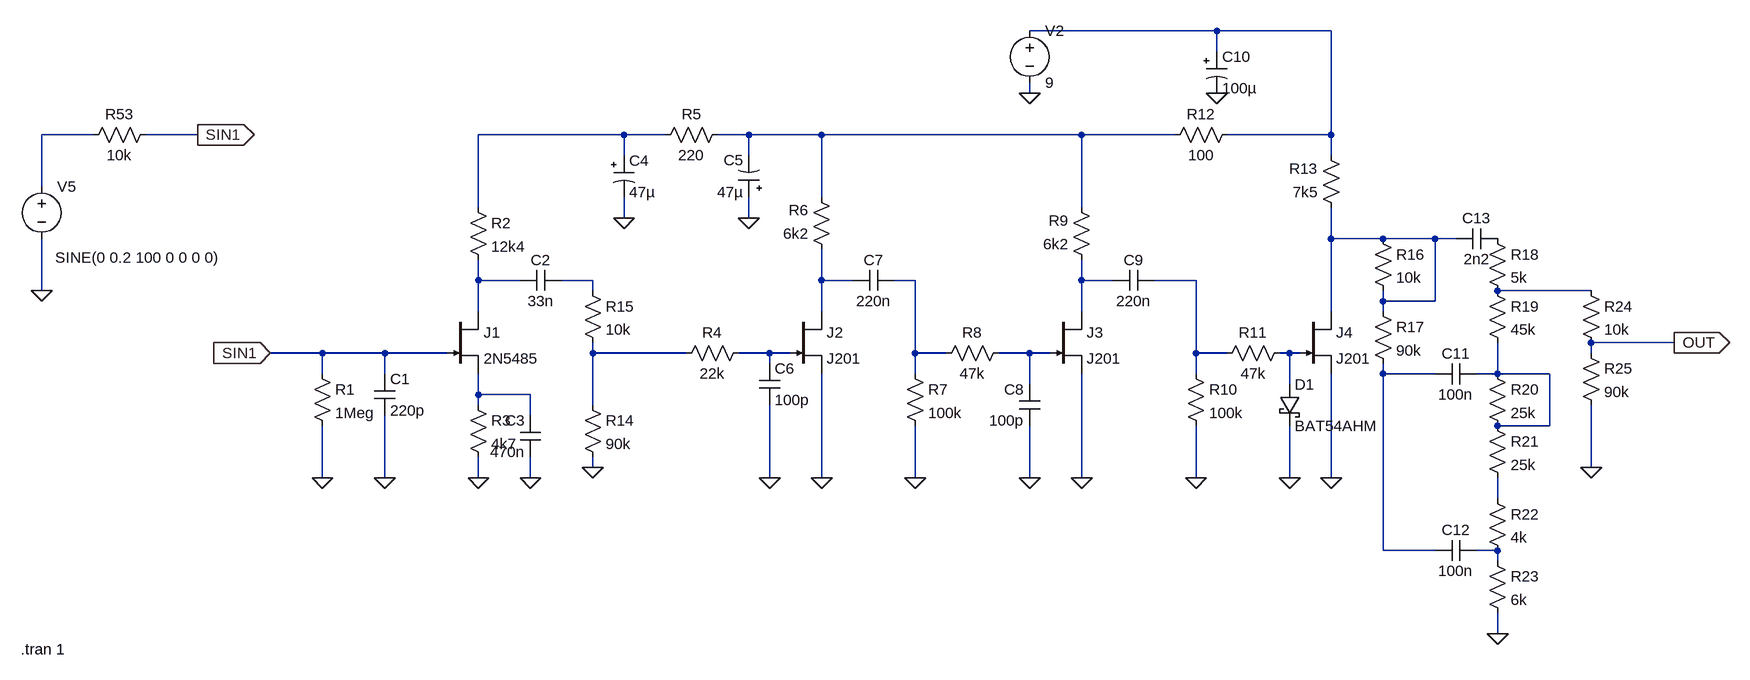
[diagram p0: schematic krankenbox_oscillations.asc]
krankenbox_oscillations.asc, the LTspice schematic file:
Version 4
SHEET 1 4396 1780
WIRE 1360 -400 1072 -400
WIRE 1536 -400 1360 -400
WIRE 1360 -368 1360 -400
WIRE 1072 -304 1072 -320
WIRE -368 -240 -448 -240
WIRE -208 -240 -288 -240
WIRE 448 -240 224 -240
WIRE 512 -240 448 -240
WIRE 640 -240 592 -240
WIRE 752 -240 640 -240
WIRE 1152 -240 752 -240
WIRE 1296 -240 1152 -240
WIRE 1536 -240 1536 -400
WIRE 1536 -240 1376 -240
WIRE 448 -208 448 -240
WIRE 640 -208 640 -240
WIRE 1536 -208 1536 -240
WIRE -448 -160 -448 -240
WIRE 752 -144 752 -240
WIRE 224 -128 224 -240
WIRE 1152 -128 1152 -240
WIRE 448 -112 448 -144
WIRE 640 -112 640 -144
WIRE 1536 -80 1536 -128
WIRE 1616 -80 1536 -80
WIRE 1696 -80 1616 -80
WIRE 1728 -80 1696 -80
WIRE 224 -16 224 -48
WIRE 288 -16 224 -16
WIRE 400 -16 352 -16
WIRE 752 -16 752 -64
WIRE 800 -16 752 -16
WIRE 896 -16 864 -16
WIRE 1152 -16 1152 -48
WIRE 1200 -16 1152 -16
WIRE 1328 -16 1264 -16
WIRE -448 0 -448 -80
WIRE 400 0 400 -16
WIRE 1936 0 1792 0
WIRE 1616 16 1616 0
WIRE 1696 16 1696 -80
WIRE 1696 16 1616 16
WIRE 224 32 224 -16
WIRE 752 32 752 -16
WIRE 1152 32 1152 -16
WIRE 1536 32 1536 -80
WIRE 1616 32 1616 16
WIRE 2064 80 1936 80
WIRE -16 96 -96 96
WIRE 80 96 -16 96
WIRE 176 96 80 96
WIRE 400 96 400 80
WIRE 544 96 400 96
WIRE 672 96 624 96
WIRE 704 96 672 96
WIRE 896 96 896 -16
WIRE 944 96 896 96
WIRE 1072 96 1024 96
WIRE 1104 96 1072 96
WIRE 1328 96 1328 -16
WIRE 1376 96 1328 96
WIRE 1472 96 1456 96
WIRE 1488 96 1472 96
WIRE 1936 96 1936 80
WIRE 672 112 672 96
WIRE -16 128 -16 96
WIRE 80 128 80 96
WIRE 896 128 896 96
WIRE 1328 128 1328 96
WIRE 1616 128 1616 112
WIRE 1696 128 1616 128
WIRE 1792 128 1792 80
WIRE 1792 128 1760 128
WIRE 1872 128 1792 128
WIRE 1072 144 1072 96
WIRE 1472 144 1472 96
WIRE 224 160 224 128
WIRE 304 160 224 160
WIRE 224 176 224 160
WIRE 400 176 400 96
WIRE 304 192 304 160
WIRE 1872 208 1872 128
WIRE 1872 208 1792 208
WIRE 400 272 400 256
WIRE 1936 272 1936 176
WIRE -16 288 -16 208
WIRE 80 288 80 192
WIRE 224 288 224 256
WIRE 304 288 304 256
WIRE 672 288 672 176
WIRE 752 288 752 128
WIRE 896 288 896 208
WIRE 1072 288 1072 208
WIRE 1152 288 1152 128
WIRE 1328 288 1328 208
WIRE 1472 288 1472 208
WIRE 1536 288 1536 128
WIRE 1792 320 1792 288
WIRE 1616 400 1616 128
WIRE 1696 400 1616 400
WIRE 1792 400 1760 400
WIRE 1792 416 1792 400
WIRE 1792 528 1792 496
FLAG -16 288 0
FLAG 80 288 0
FLAG 224 288 0
FLAG 304 288 0
FLAG 672 288 0
FLAG 752 288 0
FLAG 896 288 0
FLAG 1072 288 0
FLAG 1152 288 0
FLAG 1328 288 0
FLAG 1536 288 0
FLAG 448 -112 0
FLAG 640 -112 0
FLAG 1792 528 0
FLAG 1936 272 0
FLAG 1360 -304 0
FLAG 400 272 0
FLAG 1072 -304 0
FLAG -96 96 SIN1
IOPIN -96 96 In
FLAG 1472 288 0
FLAG -448 0 0
FLAG -208 -240 SIN1
IOPIN -208 -240 Out
FLAG 2064 80 OUT
IOPIN 2064 80 Out
SYMBOL res -32 112 R0
SYMATTR InstName R1
SYMATTR Value 1Meg
SYMBOL res 208 -144 R0
SYMATTR InstName R2
SYMATTR Value 12k4
SYMBOL res 208 160 R0
SYMATTR InstName R3
SYMATTR Value 4k7
SYMBOL res 640 80 R90
WINDOW 0 0 56 VBottom 2
WINDOW 3 32 56 VTop 2
SYMATTR InstName R4
SYMATTR Value 22k
SYMBOL res 608 -256 R90
WINDOW 0 0 56 VBottom 2
WINDOW 3 32 56 VTop 2
SYMATTR InstName R5
SYMATTR Value 220
SYMBOL res 768 -48 R180
WINDOW 0 36 76 Left 2
WINDOW 3 36 40 Left 2
SYMATTR InstName R6
SYMATTR Value 6k2
SYMBOL res 880 112 R0
SYMATTR InstName R7
SYMATTR Value 100k
SYMBOL res 1040 80 R90
WINDOW 0 0 56 VBottom 2
WINDOW 3 32 56 VTop 2
SYMATTR InstName R8
SYMATTR Value 47k
SYMBOL res 1168 -32 R180
WINDOW 0 36 76 Left 2
WINDOW 3 36 40 Left 2
SYMATTR InstName R9
SYMATTR Value 6k2
SYMBOL res 1312 112 R0
SYMATTR InstName R10
SYMATTR Value 100k
SYMBOL res 1472 80 R90
WINDOW 0 0 56 VBottom 2
WINDOW 3 32 56 VTop 2
SYMATTR InstName R11
SYMATTR Value 47k
SYMBOL res 1392 -256 R90
WINDOW 0 0 56 VBottom 2
WINDOW 3 32 56 VTop 2
SYMATTR InstName R12
SYMATTR Value 100
SYMBOL res 1552 -112 R180
WINDOW 0 36 76 Left 2
WINDOW 3 36 40 Left 2
SYMATTR InstName R13
SYMATTR Value 7k5
SYMBOL cap 64 128 R0
SYMATTR InstName C1
SYMATTR Value 220p
SYMBOL cap 352 -32 R90
WINDOW 0 0 32 VBottom 2
WINDOW 3 32 32 VTop 2
SYMATTR InstName C2
SYMATTR Value 33n
SYMBOL cap 320 256 R180
WINDOW 0 24 56 Left 2
WINDOW 3 24 8 Left 2
SYMATTR InstName C3
SYMATTR Value 470n
SYMBOL polcap 432 -208 R0
SYMATTR InstName C4
SYMATTR Value 47µ
SYMATTR Description Capacitor
SYMATTR Type cap
SYMATTR SpiceLine V=25 Irms=170m Rser=1 Lser=0 mfg="Nichicon" pn="UPG1E470MPH" type="Al electrolytic"
SYMBOL polcap 656 -144 R180
WINDOW 0 24 57 Left 2
WINDOW 3 24 8 Left 2
SYMATTR InstName C5
SYMATTR Value 47µ
SYMATTR Description Capacitor
SYMATTR Type cap
SYMATTR SpiceLine V=25 Irms=170m Rser=1 Lser=0 mfg="Nichicon" pn="UPG1E470MPH" type="Al electrolytic"
SYMBOL cap 656 112 R0
SYMATTR InstName C6
SYMATTR Value 100p
SYMBOL cap 864 -32 R90
WINDOW 0 0 32 VBottom 2
WINDOW 3 32 32 VTop 2
SYMATTR InstName C7
SYMATTR Value 220n
SYMBOL cap 1088 208 R180
WINDOW 0 24 56 Left 2
WINDOW 3 24 8 Left 2
SYMATTR InstName C8
SYMATTR Value 100p
SYMBOL cap 1200 0 R270
WINDOW 0 32 32 VTop 2
WINDOW 3 0 32 VBottom 2
SYMATTR InstName C9
SYMATTR Value 220n
SYMBOL polcap 1344 -368 R0
WINDOW 3 24 56 Left 2
SYMATTR Value 100µ
SYMATTR InstName C10
SYMATTR Description Capacitor
SYMATTR Type cap
SYMATTR SpiceLine V=16 Irms=170m Rser=1 Lser=0 mfg="Nichicon" pn="UPG1C101MPH" type="Al electrolytic"
SYMBOL cap 1760 112 R90
WINDOW 0 0 32 VBottom 2
WINDOW 3 32 32 VTop 2
SYMATTR InstName C11
SYMATTR Value 100n
SYMBOL cap 1760 384 R90
WINDOW 0 0 32 VBottom 2
WINDOW 3 32 32 VTop 2
SYMATTR InstName C12
SYMATTR Value 100n
SYMBOL cap 1792 -96 R90
WINDOW 0 0 32 VBottom 2
WINDOW 3 32 32 VTop 2
SYMATTR InstName C13
SYMATTR Value 2n2
SYMBOL njf 176 32 R0
SYMATTR InstName J1
SYMATTR Value 2N5485
SYMBOL res 384 160 R0
SYMATTR InstName R14
SYMATTR Value 90k
SYMBOL res 384 -16 R0
SYMATTR InstName R15
SYMATTR Value 10k
SYMBOL res 1600 -96 R0
SYMATTR InstName R16
SYMATTR Value 10k
SYMBOL res 1600 16 R0
SYMATTR InstName R17
SYMATTR Value 90k
SYMBOL res 1776 -96 R0
SYMATTR InstName R18
SYMATTR Value 5k
SYMBOL res 1776 -16 R0
SYMATTR InstName R19
SYMATTR Value 45k
SYMBOL res 1776 112 R0
SYMATTR InstName R20
SYMATTR Value 25k
SYMBOL res 1776 192 R0
SYMATTR InstName R21
SYMATTR Value 25k
SYMBOL res 1776 304 R0
SYMATTR InstName R22
SYMATTR Value 4k
SYMBOL res 1776 400 R0
SYMATTR InstName R23
SYMATTR Value 6k
SYMBOL res 1920 -16 R0
SYMATTR InstName R24
SYMATTR Value 10k
SYMBOL res 1920 80 R0
SYMATTR InstName R25
SYMATTR Value 90k
SYMBOL voltage 1072 -416 R0
WINDOW 123 0 0 Left 2
WINDOW 39 0 0 Left 2
SYMATTR InstName V2
SYMATTR Value 9
SYMBOL njf 704 32 R0
SYMATTR InstName J2
SYMATTR Value J201
SYMBOL njf 1104 32 R0
SYMATTR InstName J3
SYMATTR Value J201
SYMBOL njf 1488 32 R0
SYMATTR InstName J4
SYMATTR Value J201
SYMBOL voltage -448 -176 R0
WINDOW 3 21 125 Left 2
WINDOW 39 0 0 Left 2
SYMATTR Value SINE(0 0.2 100 0 0 0 0)
SYMATTR Value2 AC 1V
SYMATTR InstName V5
SYMBOL res -272 -256 R90
WINDOW 0 0 56 VBottom 2
WINDOW 3 32 56 VTop 2
SYMATTR InstName R53
SYMATTR Value 10k
SYMBOL schottky 1456 144 R0
SYMATTR InstName D1
SYMATTR Value BAT54AHM
SYMATTR Description Diode
SYMATTR Type diode
TEXT -480 552 Left 2 !.tran 1

The netlist it stands for:
* krankenbox_oscillations.asc
R1 SIN1 0 1Meg
R2 N003 N006 12k4
R3 N019 0 4k7
R4 N014 N013 22k
R5 N004 N003 220
R6 N008 N004 6k2
R7 N009 0 100k
R8 N015 N009 47k
R9 N010 N004 6k2
R10 N011 0 100k
R11 N016 N011 47k
R12 N001 N004 100
R13 N005 N001 7k5
C1 SIN1 0 220p
C2 N007 N006 33n
C3 0 N019 470n
C4 N003 0 47µ V=25 Irms=170m Rser=1 Lser=0 mfg="Nichicon" pn="UPG1E470MPH" type="Al electrolytic"
C5 0 N004 47µ V=25 Irms=170m Rser=1 Lser=0 mfg="Nichicon" pn="UPG1E470MPH" type="Al electrolytic"
C6 N014 0 100p
C7 N009 N008 220n
C8 0 N015 100p
C9 N010 N011 220n
C10 N001 0 100µ V=16 Irms=170m Rser=1 Lser=0 mfg="Nichicon" pn="UPG1C101MPH" type="Al electrolytic"
C11 N018 N017 100n
C12 N021 N017 100n
C13 P001 N005 2n2
J1 N006 SIN1 N019 2N5485
R14 N013 0 90k
R15 N007 N013 10k
R16 N005 N005 10k
R17 N005 N017 90k
R18 P001 N012 5k
R19 N012 N018 45k
R20 N018 N018 25k
R21 N018 N020 25k
R22 N020 N021 4k
R23 N021 0 6k
R24 N012 OUT 10k
R25 OUT 0 90k
V2 N001 0 9
J2 N008 N014 0 J201
J3 N010 N015 0 J201
J4 N005 N016 0 J201
V5 N002 0 SINE(0 0.2 100 0 0 0 0) AC 1V
R53 SIN1 N002 10k
D1 N016 0 BAT54AHM
.model D D
.lib standard.dio
.model NJF NJF
.model PJF PJF
.lib standard.jft
.tran 1
.backanno
.end